# EasyEDA schematic SCH_μAtlas_2026-06-21.json

## Sheets
1 PWR_Management: TITLE: PWR Management; REV: 1.0; Date: 2026-06-20; Sheet: 1/1; Drawn By: httperry; Company: HackClub - Macondo
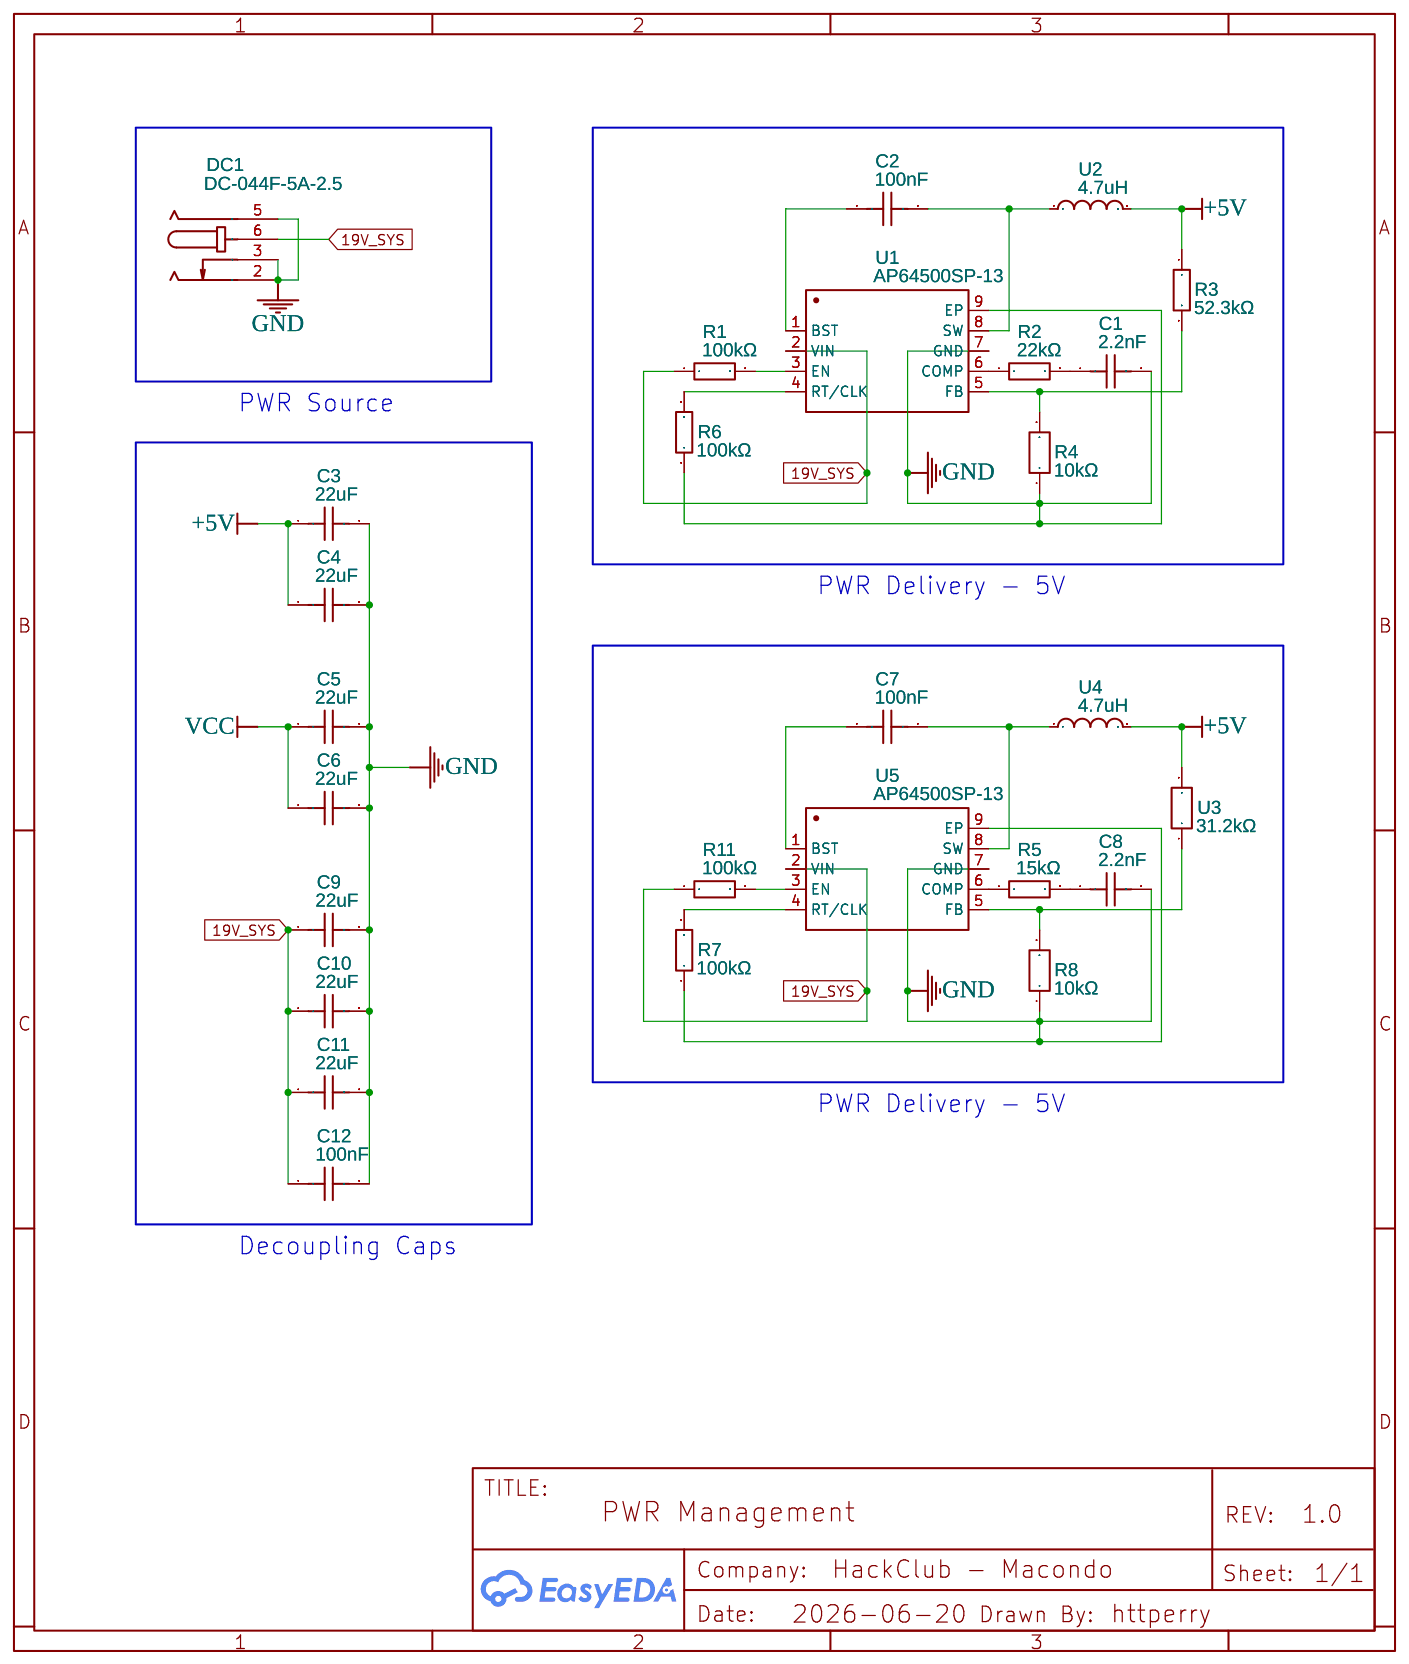
[diagram p0: PWR_Management]
2 SATA_Ports: TITLE: SATA Ports; Date: 2026-06-21
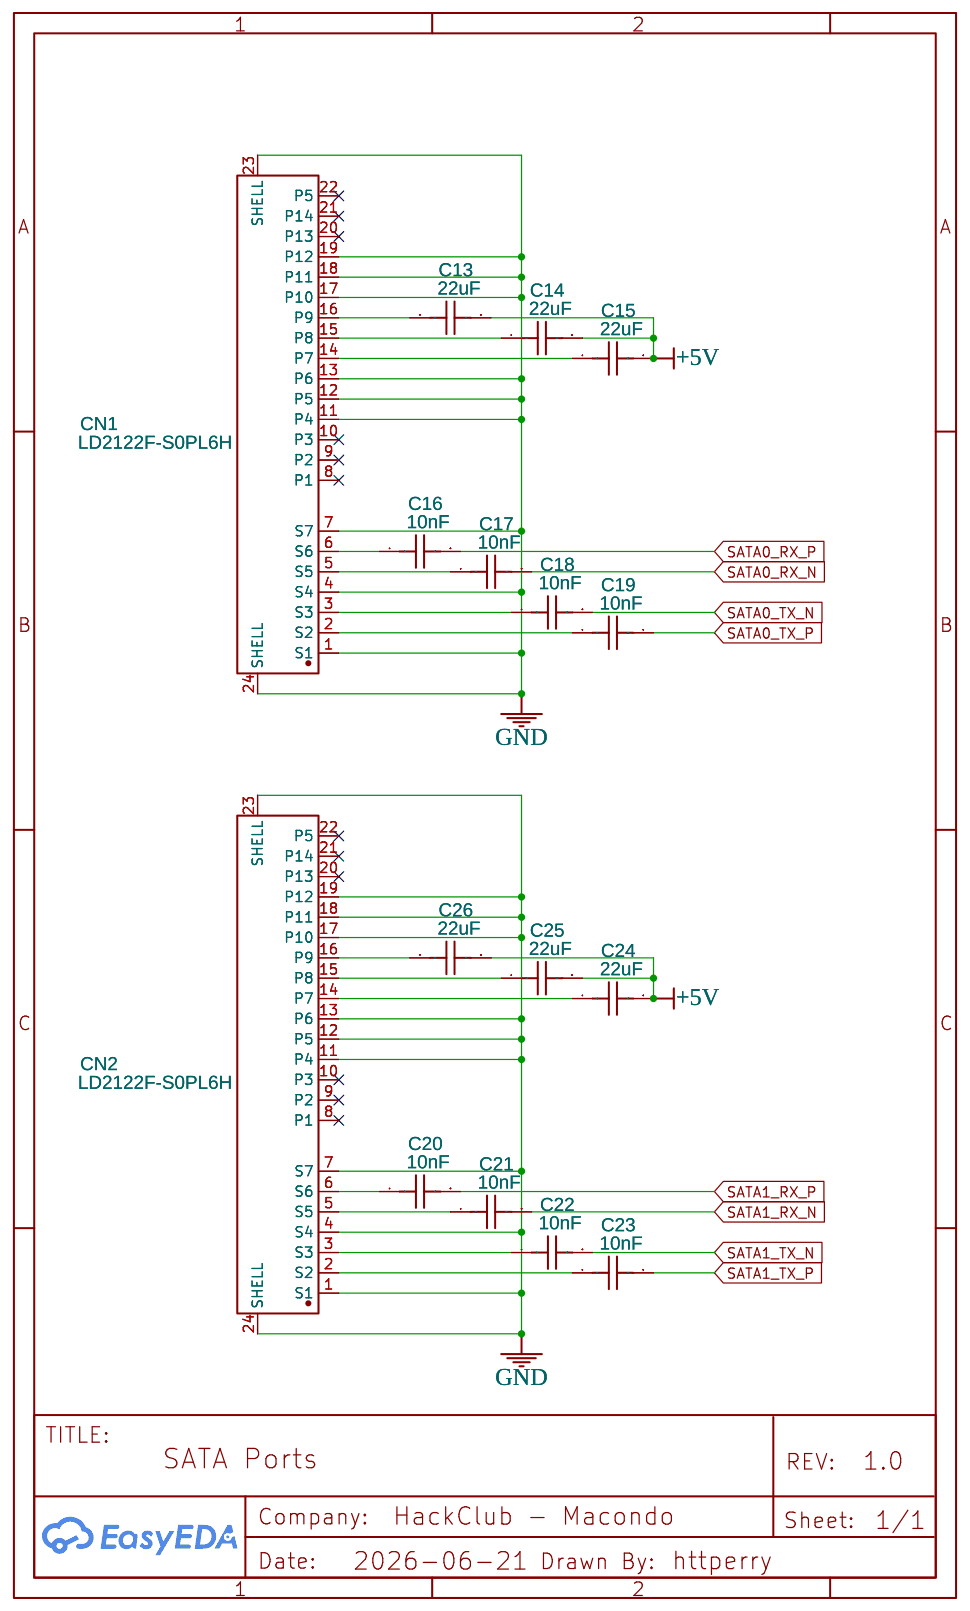
[diagram p1: SATA_Ports]
3 NVMe_(Networking)_Ports: TITLE: NVMe (Networking) Ports; Date: 2026-06-21; Company: HackClub Macondo
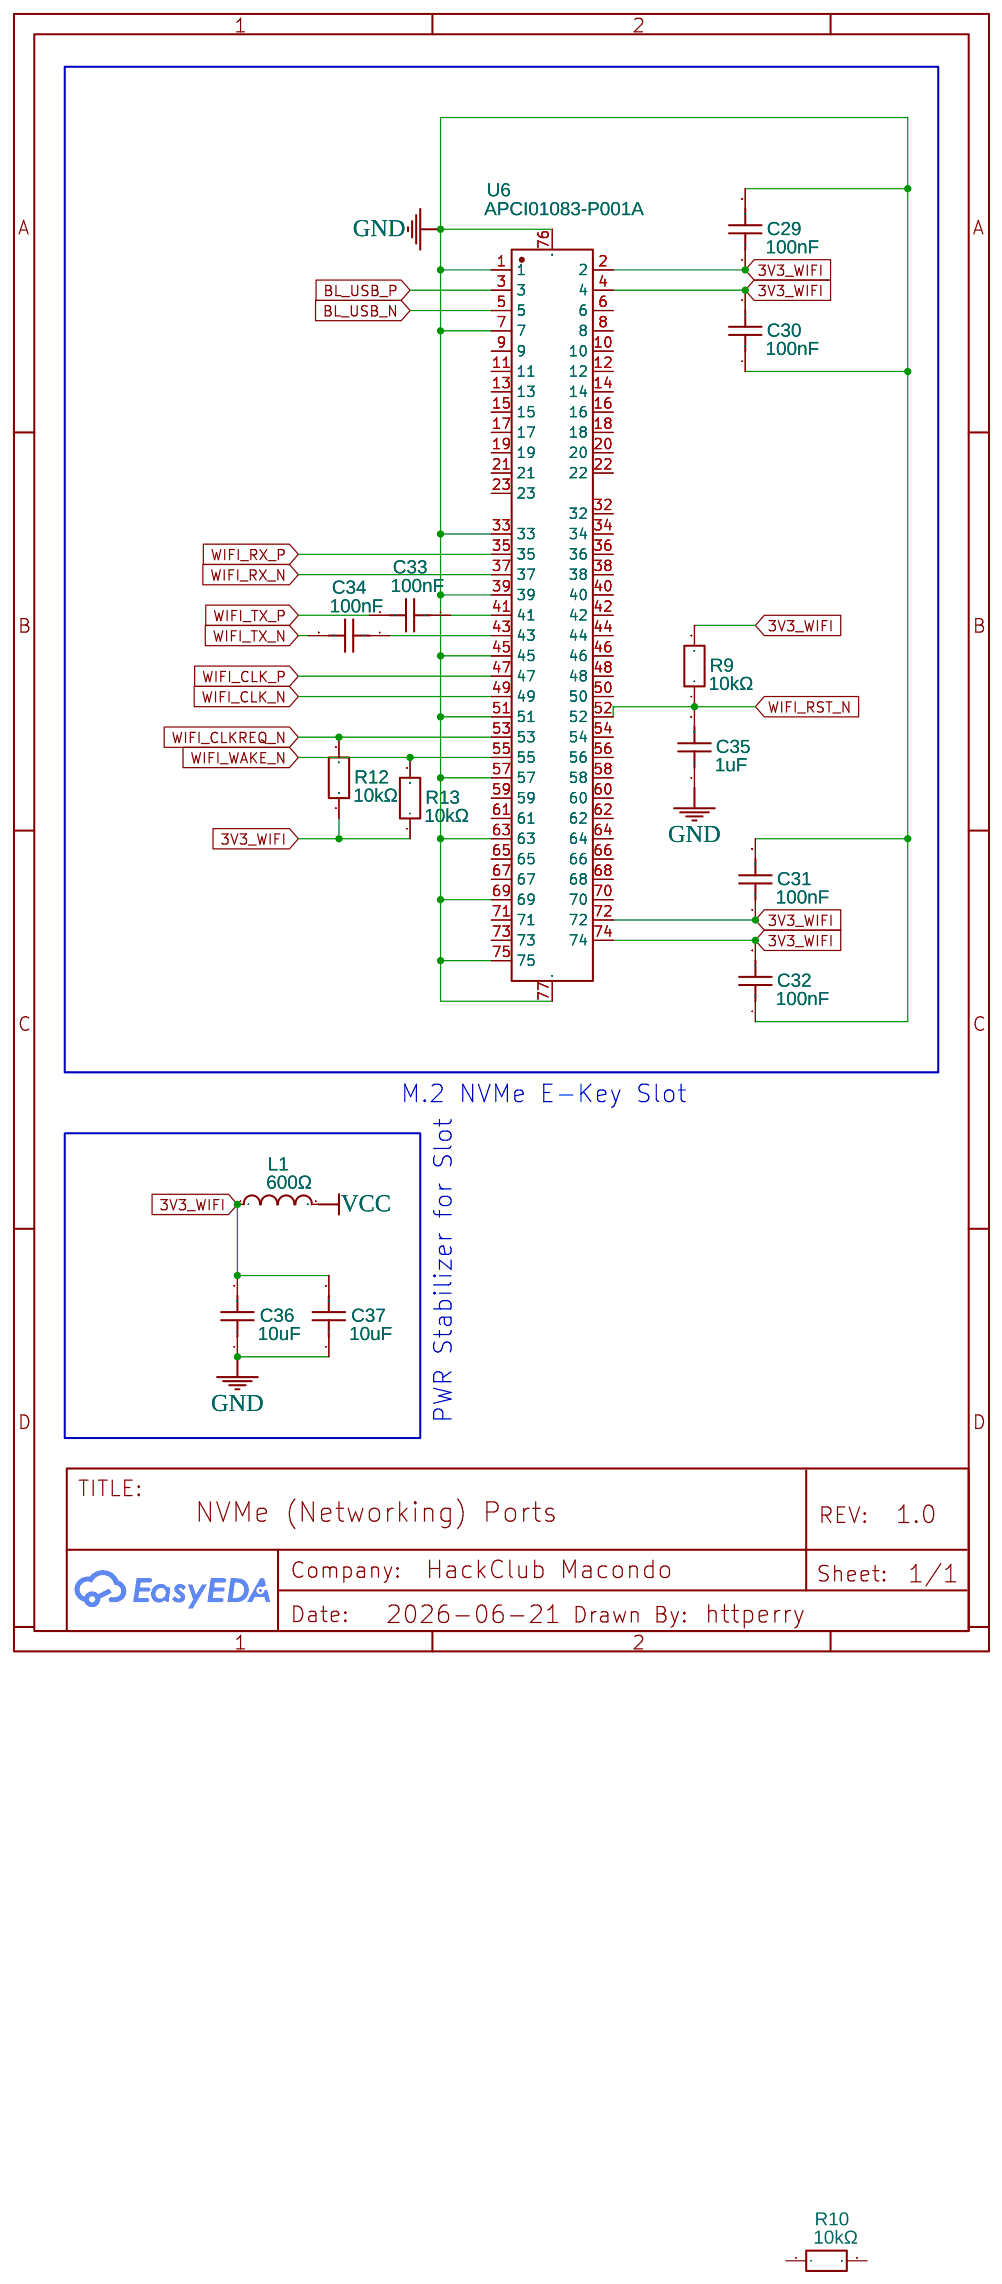
[diagram p2: NVMe_(Networking)_Ports]

## Parts
sheet NVMe_(Networking)_Ports
C29  100nF  [C0402]
C30  100nF  [C0402]
C31  100nF  [C0402]
C32  100nF  [C0402]
C33  100nF  [C0402]
C34  100nF  [C0402]
C35  1uF  [C0402]
C36  10uF  [C0805]
C37  10uF  [C0805]
L1  600Ω  [L0805]
R9  10kΩ  [R0402]
R10  10kΩ  [R0402]
R12  10kΩ  [R0402]
R13  10kΩ  [R0402]
U6  APCI01083-P001A  [CONN-SMD_APCI01083-P001A]
sheet PWR_Management
C1  2.2nF  [C0603]
C2  100nF  [C0603]
C3  22uF  [C0603]
C4  22uF  [C0603]
C5  22uF  [C0603]
C6  22uF  [C0603]
C7  100nF  [C0603]
C8  2.2nF  [C0603]
C9  22uF  [CAP-SMD_L6.1-W5.3-L]
C10  22uF  [CAP-SMD_L6.1-W5.3-L]
C11  22uF  [CAP-SMD_L6.1-W5.3-L]
C12  100nF  [C0603]
DC1  DC-044F-5A-2.5  [DC-IN-TH_DC-044F-5A-2.5]
R1  100kΩ  [R0603]
R2  22kΩ  [R0603]
R3  52.3kΩ  [R0603]
R4  10kΩ  [R0603]
R5  15kΩ  [R0603]
R6  100kΩ  [R0603]
R7  100kΩ  [R0603]
R8  10kΩ  [R0603]
R11  100kΩ  [R0603]
U1  AP64500SP-13  [SO-8_L4.9-W3.9-P1.27-LS6.0-BL-EP]
U2  4.7uH  [IND-SMD_L7.0-W6.6_APH0630]
U3  31.2kΩ  [R0603]
U4  4.7uH  [IND-SMD_L7.0-W6.6_APH0630]
U5  AP64500SP-13  [SO-8_L4.9-W3.9-P1.27-LS6.0-BL-EP]
sheet SATA_Ports
C13  22uF  [C0603]
C14  22uF  [C0603]
C15  22uF  [C0603]
C16  10nF  [C0402]
C17  10nF  [C0402]
C18  10nF  [C0402]
C19  10nF  [C0402]
C20  10nF  [C0402]
C21  10nF  [C0402]
C22  10nF  [C0402]
C23  10nF  [C0402]
C24  22uF  [C0603]
C25  22uF  [C0603]
C26  22uF  [C0603]
CN1  LD2122F-S0PL6H  [CONN-SMD_LD2122F-S0PL6H]
CN2  LD2122F-S0PL6H  [CONN-SMD_LD2122F-S0PL6H]

## Library data of the parts
C29-C34 = CC0402KRX5R6BB104: Contributor: LCSC; Supplier: LCSC; Supplier Part: C129131; Manufacturer: YAGEO(国巨); JLCPCB Part Class: Extended Part
C35 = TCC0402X5R105K160AT: Contributor: lcsc; Supplier: LCSC; Supplier Part: C5142580; Manufacturer: CCTC(三环); JLCPCB Part Class: Extended Part
C36 C37 = CGA0805X5R106K500MT: Supplier: LCSC; Supplier Part: C6119889; Manufacturer: HRE(芯声); JLCPCB Part Class: Extended Part; Contributor: lcsc
L1 = MPZ2012S601AT000: Supplier: LCSC; Manufacturer: TDK; Supplier Part: C21519; JLCPCB Part Class: Extended Part
R9 = FRC0402F1002TS: Contributor: LCSC; Supplier: LCSC; Supplier Part: C2906861; Manufacturer: FOJAN(富捷); JLCPCB Part Class: Extended Part
R10 R12 R13 = FRC0402F1002TS: Contributor: LCSC; Supplier: LCSC; Supplier Part: C2906861; Manufacturer: FOJAN(富捷); JLCPCB Part Class: Extended Part; link: https://lcsc.com/eda_search?q=C2906861&%26type=1&ref=editor
U6 = APCI01083-P001A: Supplier: LCSC; Supplier Part: C41425435; Manufacturer: LX(连欣科技); JLCPCB Part Class: Extended Part; Contributor: lcsc
C1 C8 = FCC0603B222K500CT: Supplier: LCSC; Supplier Part: C5137562; Manufacturer: FOJAN(富捷); Contributor: lcsc; JLCPCB Part Class: Extended Part
C2 C7 C12 = GRM188R71H104KA93D: Supplier: LCSC; Manufacturer: muRata(村田); Supplier Part: C77055; JLCPCB Part Class: Extended Part
C3-C6 C13-C15 C24-C26 = HGC0603R5226M160NTHJ: Supplier: LCSC; Supplier Part: C22367828; Manufacturer: Chinocera(华瓷); JLCPCB Part Class: Extended Part; Contributor: lcsc
C9-C11 = KCM55QR71H226KH13K: Supplier: LCSC; Supplier Part: C6579204; Manufacturer: muRata(村田); JLCPCB Part Class: Extended Part; Contributor: lcsc
DC1 = DC-044F-5A-2.5: Supplier: LCSC; Supplier Part: C779941; Manufacturer: XKB Connection(中国星坤); JLCPCB Part Class: Extended Part; Contributor: lcsc
R1 R6 R7 R11 = RS-03K1003FT_C115320: Contributor: LCSC; Supplier: LCSC; Manufacturer: FH(风华); Manufacturer Part: RS-03K1003FT; Supplier Part: C115320; JLCPCB Part Class: Extended Part
R2 = RS-03K2202FT: Contributor: LCSC; Supplier: LCSC; Supplier Part: C286577; Manufacturer: FH(风华); JLCPCB Part Class: Extended Part
R3 = RS-03K5232FT: Contributor: LCSC; Supplier: LCSC; Supplier Part: C304764; Manufacturer: FH(风华); JLCPCB Part Class: Extended Part
R4 R8 = AR03BTS1002: Supplier: LCSC; Supplier Part: C20607729; Manufacturer: Viking(光颉); JLCPCB Part Class: Extended Part; Contributor: lcsc
R5 = CR0603FA1502G: Supplier: LCSC; Manufacturer: LIZ(丽智电子); Supplier Part: C100780; JLCPCB Part Class: Extended Part
U1 U5 = AP64500SP-13: Contributor: LCSC; Supplier: LCSC; Supplier Part: C2070920; Manufacturer: DIODES(美台); JLCPCB Part Class: Extended Part
U2 U4 = APH0630T4R7M: Supplier: LCSC; Supplier Part: C5349705; Manufacturer: APV(爱普微); JLCPCB Part Class: Extended Part; Contributor: lcsc
U3 = RT0603DRE0731K2L: Supplier: LCSC; Supplier Part: C863036; Manufacturer: YAGEO(国巨); JLCPCB Part Class: Extended Part; Contributor: lcsc
C16-C23 = FCC0402B103K500AT: Supplier: LCSC; Supplier Part: C5137480; Manufacturer: FOJAN(富捷); JLCPCB Part Class: Extended Part; Contributor: lcsc; link: https://lcsc.com/eda_search?q=C5137480&%26type=1&ref=editor
CN1 CN2 = LD2122F-S0PL6H: Contributor: LCSC; Supplier: LCSC; Supplier Part: C2761452; Manufacturer: FOXCONN(富士康); JLCPCB Part Class: Extended Part

## Nets
3V3_WIFI: C29.1 C30.2 C31.1 C32.2 C36.2 C37.2 L1.1 R9.2 R12.1 R13.1 U6.2 U6.4 U6.72 U6.74
19V_SYS: C9.1 C10.1 C11.1 C12.1 DC1.6 R1.1 R11.1 U1.2(VIN) U5.2(VIN)
+5V: C3.1 C4.1 C13.2 C14.2 C15.2 C24.2 C25.2 C26.2 R3.1 U2.2 U3.2 U4.2
GND: C1.2 C3.2 C4.2 C5.2 C6.2 C8.2 C9.2 C10.2 C11.2 C12.2 C29.2 C30.1 C31.2 C32.1 C35.1 C36.1 C37.1 CN1.1(S1) CN1.4(S4) CN1.7(S7) CN1.11(P4) CN1.12(P5) CN1.13(P6) CN1.17(P10) CN1.18(P11) CN1.19(P12) CN1.23(SHELL) CN1.24(SHELL) CN2.1(S1) CN2.4(S4) CN2.7(S7) CN2.11(P4) CN2.12(P5) CN2.13(P6) CN2.17(P10) CN2.18(P11) CN2.19(P12) CN2.23(SHELL) CN2.24(SHELL) DC1.2 DC1.3 DC1.5 R4.1 R6.1 R7.1 R8.1 U1.7(GND) U1.9(EP) U5.7(GND) U5.9(EP) U6.1 U6.7 U6.33 U6.39 U6.45 U6.51 U6.57 U6.63 U6.69 U6.75 U6.76 U6.77
VCC: C5.1 C6.1 L1.2
BL_USB_N: U6.5
BL_USB_P: U6.3
SATA0_RX_N: C17.2
SATA0_RX_P: C16.2
SATA0_TX_N: C18.2
SATA0_TX_P: C19.2
SATA1_RX_N: C21.2
SATA1_RX_P: C20.2
SATA1_TX_N: C22.2
SATA1_TX_P: C23.2
WIFI_CLK_N: U6.49
WIFI_CLK_P: U6.47
WIFI_CLKREQ_N: R12.2 U6.53
WIFI_RST_N: C35.2 R9.1 U6.52
WIFI_RX_N: U6.37
WIFI_RX_P: U6.35
WIFI_TX_N: C34.2
WIFI_TX_P: C33.2
WIFI_WAKE_N: R13.2 U6.55
Net-(C1-1): C1.1 R2.2
Net-(C2-1): C2.1 U1.1(BST)
Net-(C2-2): C2.2 U1.8(SW) U2.1
Net-(C7-1): C7.1 U5.1(BST)
Net-(C7-2): C7.2 U4.1 U5.8(SW)
Net-(C8-1): C8.1 R5.2
Net-(C13-1): C13.1 CN1.16(P9)
Net-(C14-1): C14.1 CN1.15(P8)
Net-(C15-1): C15.1 CN1.14(P7)
Net-(C16-1): C16.1 CN1.6(S6)
Net-(C17-1): C17.1 CN1.5(S5)
Net-(C18-1): C18.1 CN1.3(S3)
Net-(C19-1): C19.1 CN1.2(S2)
Net-(C20-1): C20.1 CN2.6(S6)
Net-(C21-1): C21.1 CN2.5(S5)
Net-(C22-1): C22.1 CN2.3(S3)
Net-(C23-1): C23.1 CN2.2(S2)
Net-(C24-1): C24.1 CN2.14(P7)
Net-(C25-1): C25.1 CN2.15(P8)
Net-(C26-1): C26.1 CN2.16(P9)
Net-(C33-1): C33.1 U6.41
Net-(C34-1): C34.1 U6.43
Net-(R1-2): R1.2 U1.3(EN)
Net-(R2-1): R2.1 U1.6(COMP)
Net-(R3-2): R3.2 R4.2 U1.5(FB)
Net-(R5-1): R5.1 U5.6(COMP)
Net-(R6-2): R6.2 U1.4(RT/CLK)
Net-(R7-2): R7.2 U5.4(RT/CLK)
Net-(R8-2): R8.2 U3.1 U5.5(FB)
Net-(R11-2): R11.2 U5.3(EN)

Not connected (* = marked no-connect by the designer): CN1 8(P1)* 9(P2)* 10(P3)* 20(P13)* 21(P14)* 22(P5)*; CN2 8(P1)* 9(P2)* 10(P3)* 20(P13)* 21(P14)* 22(P5)*; R10 1 2; U6 6 8 9 10 11 12 13 14 15 16 17 18 19 20 21 22 23 32 34 36 38 40 42 44 46 48 50 54 56 58 59 60 61 62 64 65 66 67 68 70 71 73

## Notes on the sheets
sheet 1
- PWR Source
- PWR Delivery - 5V
- PWR Delivery - 5V
- Decoupling Caps
sheet 3
- M.2 NVMe E-Key Slot
- PWR Stabilizer for Slot
